# EAGLE design LooSensorNodeV1 (EAGLE 8.7.0)

## Sheet 1 of 5
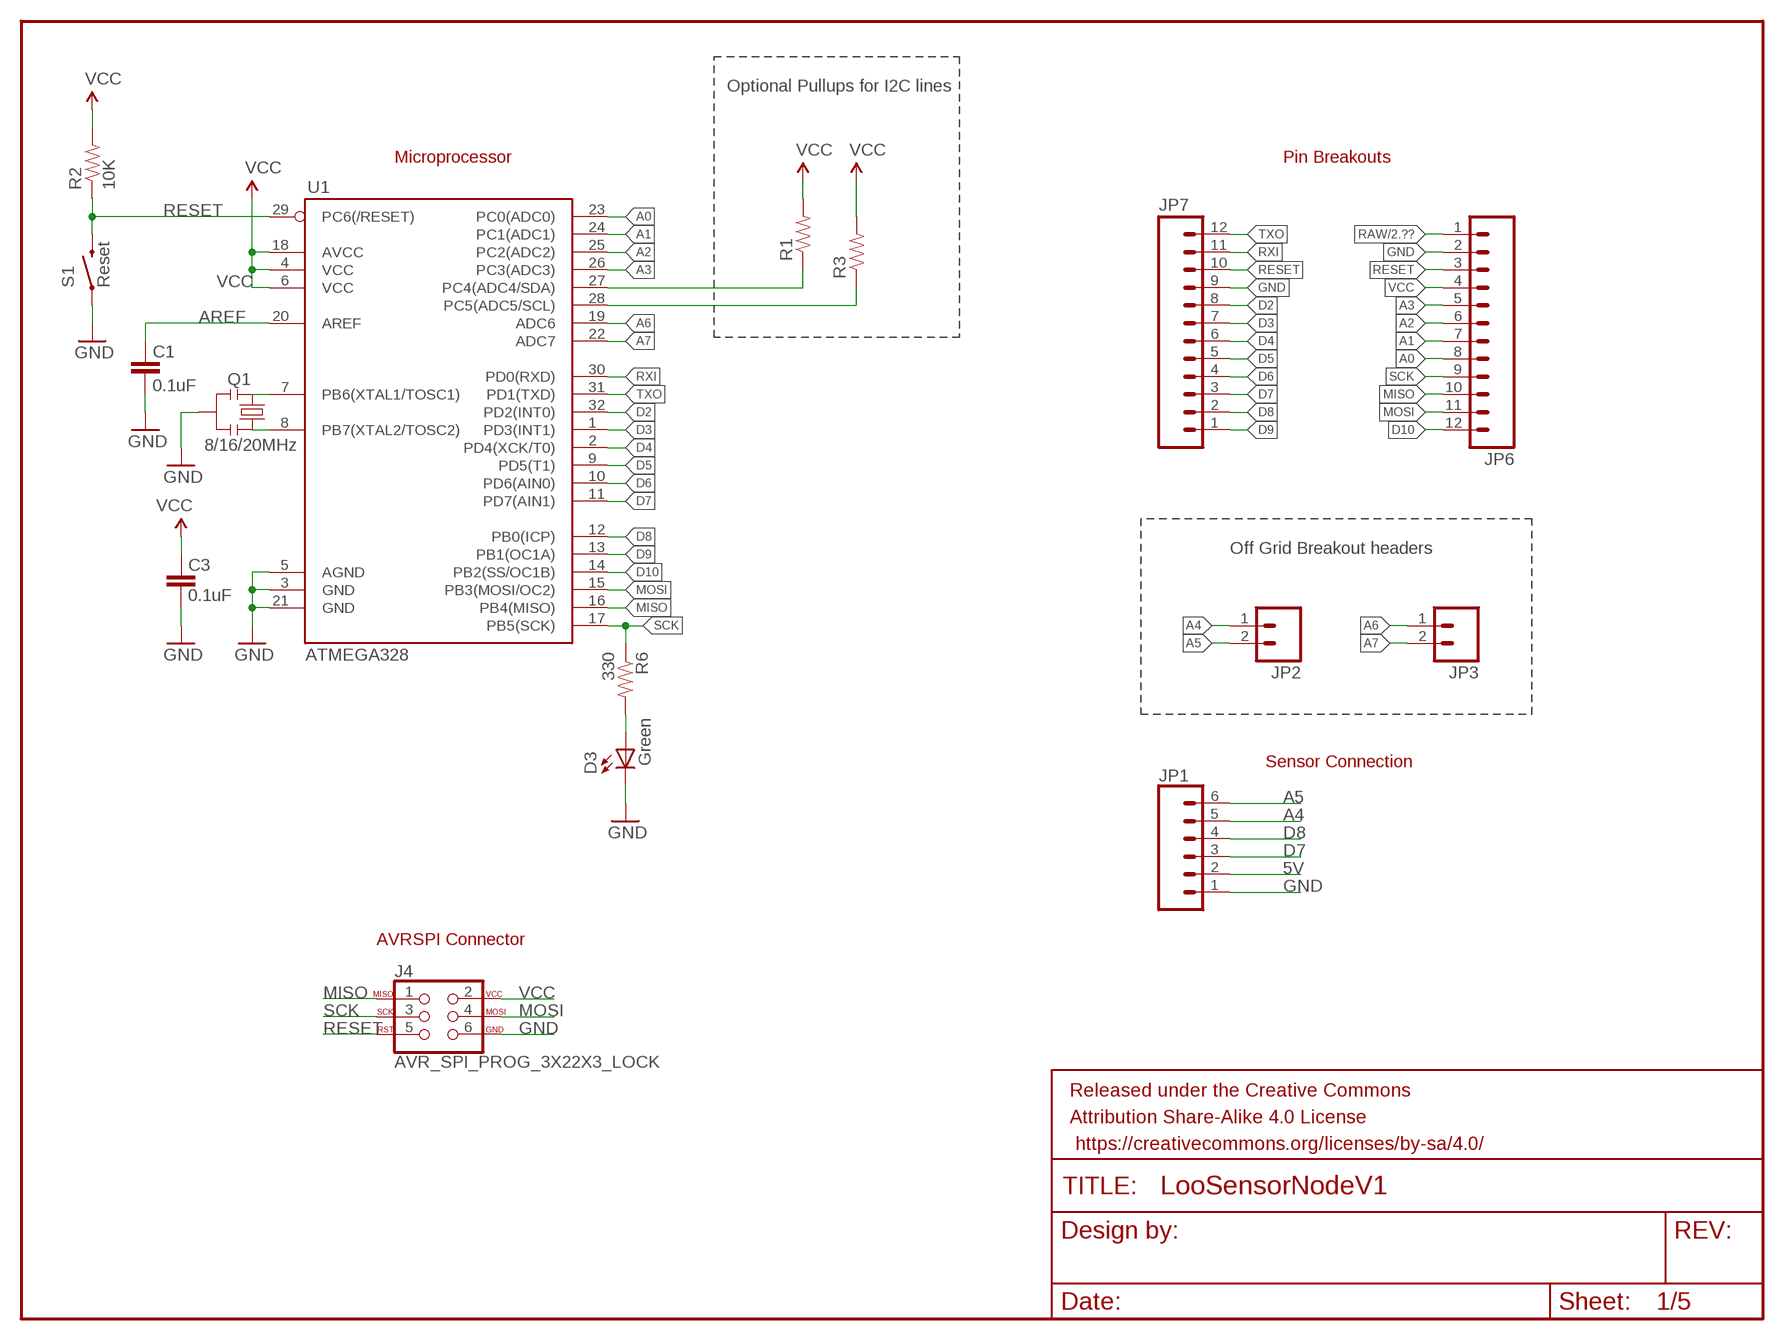
[diagram p0: schematic, sheet 1]

### Parts
C1  0.1uF  CAP0603-CAP  [0603-CAP]
C3  0.1uF  CAP0603-CAP  [0603-CAP]
D3  Green  LED  [0603-LED-ALT1]
FRAME1  FRAME-LETTER  [CREATIVE_COMMONS]
J4  AVR_SPI_PROG_3X22X3_LOCK  [2X3_LOCK]
JP1  CONN_06SILK_FEMALE_PTH  [1X06]
JP2  M02PTH  [1X02]
JP3  M02PTH  [1X02]
JP6  M12PTH  [1X12]
JP7  M12PTH  [1X12]
Q1  8/16/20MHz  RESONATOR1:1  [RESONATOR-SMD-1:1]
R1  RESISTOR0603-RES  [0603-RES]
R2  10K  RESISTOR0603-RES  [0603-RES]
R3  RESISTOR0603-RES  [0603-RES]
R6  330  RESISTOR0603-RES  [0603-RES]
S1  Reset  SWITCH-MOMENTARY-2SMD-ALT01  [TACTILE-SWITCH-SMD-ALT01]
U1  ATMEGA328  ATMEGA168  [TQFP32-08]

### Nets
5V: JP1.2 ; also sheet 2
A0: JP6.8 U1.23(PC0(ADC0))
A1: JP6.7 U1.24(PC1(ADC1))
A2: JP6.6 U1.25(PC2(ADC2))
A3: JP6.5 U1.26(PC3(ADC3))
A4: JP1.5 JP2.1 R1.1 U1.27(PC4(ADC4/SDA)) ; also sheet 5
A5: JP1.6 JP2.2 R3.1 U1.28(PC5(ADC5/SCL)) ; also sheet 5
A6: JP3.1 U1.19(ADC6)
A7: JP3.2 U1.22(ADC7)
AREF: C1.2 U1.20(AREF)
D2: JP7.8 U1.32(PD2(INT0)) ; also sheet 5
D3: JP7.7 U1.1(PD3(INT1))
D4: JP7.6 U1.2(PD4(XCK/T0)) ; also sheet 4
D5: JP7.5 U1.9(PD5(T1)) ; also sheet 3,4
D6: JP7.4 U1.10(PD6(AIN0)) ; also sheet 2
D7: JP1.3 JP7.3 U1.11(PD7(AIN1))
D8: JP1.4 JP7.2 U1.12(PB0(ICP))
D9: JP7.1 U1.13(PB1(OC1A))
D10: JP6.12 U1.14(PB2(SS/OC1B)) ; also sheet 3
GND [vcc]: C1.1 C3.1 D3.C J4.6 JP1.1 JP6.2 JP7.9 Q1.2 S1.1 S1.2 U1.3(GND) U1.5(AGND) U1.21(GND) ; also sheet 2,3,4,5
MISO: J4.1 JP6.10 U1.16(PB4(MISO)) ; also sheet 3
MOSI: J4.4 JP6.11 U1.15(PB3(MOSI/OC2)) ; also sheet 3
N$1: Q1.3 U1.8(PB7(XTAL2/TOSC2))
N$2: Q1.1 U1.7(PB6(XTAL1/TOSC1))
N$7: D3.A R6.2
RAW [vcc]: JP6.1 ; also sheet 2,5
RESET: J4.5 JP6.3 JP7.10 R2.1 S1.3 S1.4 U1.29(PC6(/RESET))
RXI: JP7.11 U1.30(PD0(RXD)) ; also sheet 4
SCK: J4.3 JP6.9 R6.1 U1.17(PB5(SCK)) ; also sheet 3
TXO: JP7.12 U1.31(PD1(TXD)) ; also sheet 4
VCC: C3.2 J4.2 JP6.4 R1.2 R2.2 R3.2 U1.4(VCC) U1.6(VCC) U1.18(AVCC) ; also sheet 2

### Notes on the sheet
- Optional Pullups for I2C lines
- Microprocessor | Pin Breakouts
- Off Grid Breakout headers
- Sensor Connection
- AVRSPI Connector

## Sheet 2 of 5
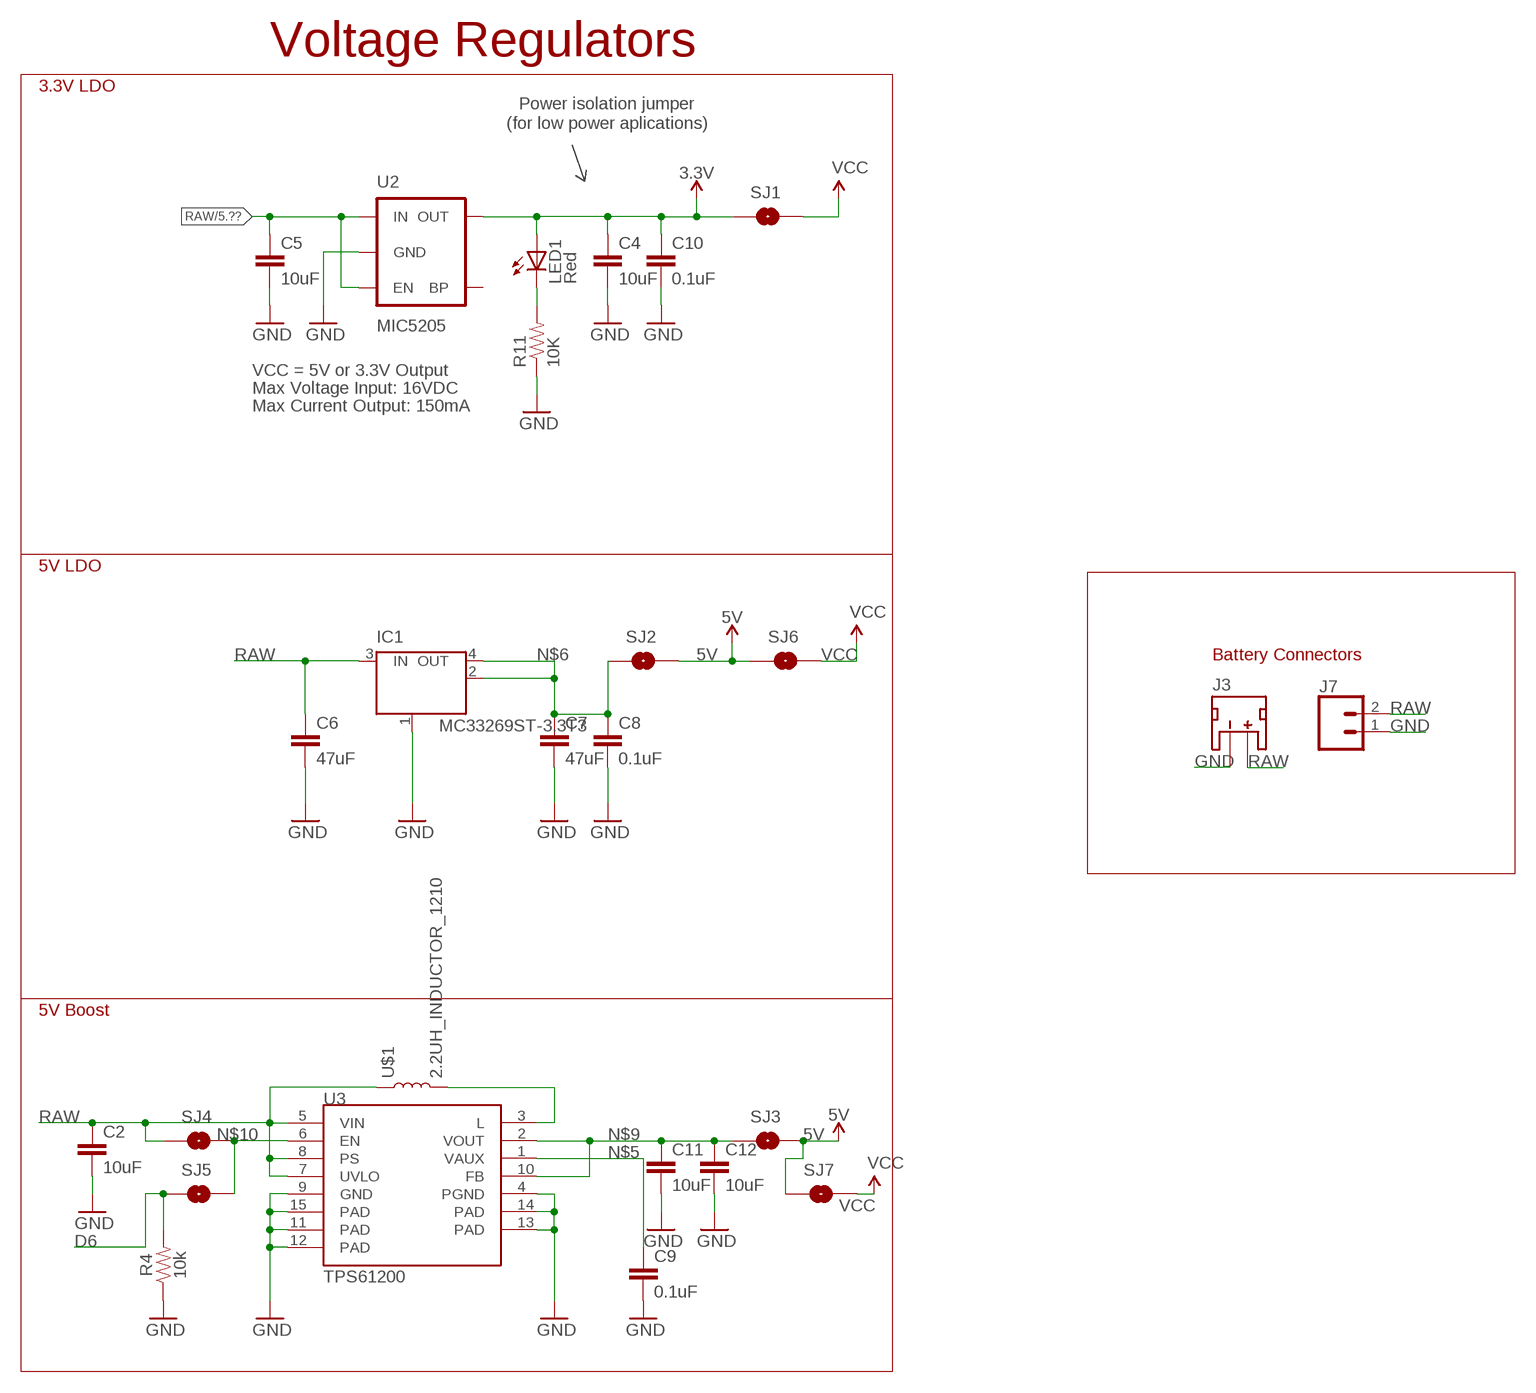
[diagram p1: schematic, sheet 2]

### Parts
C2  10uF  10UF-0603-6.3V-20%  [0603]
C4  10uF  10UF-0603-6.3V-20%  [0603]
C5  10uF  10UF-0603-6.3V-20%  [0603]
C6  47uF  10UF-1210-50V-20%  [1210]
C7  47uF  10UF-1210-50V-20%  [1210]
C8  0.1uF  0.1UF-0603-25V-5%  [0603]
C9  0.1uF  0.1UF-0603-25V-5%  [0603]
C10  0.1uF  CAP0603-CAP  [0603-CAP]
C11  10uF  10UF-0603-6.3V-20%  [0603]
C12  10uF  10UF-0603-6.3V-20%  [0603]
IC1  MC33269ST-3.3T3  [SOT223]
J3  JST_2MM_MALE  [JST-2-SMD]
J7  CONN_02  [1X02]
LED1  Red  LED  [0603-LED-ALT1]
R4  10k  10KOHM-0603-1/10W-1%  [0603]
R11  10K  RESISTOR0603-RES  [0603-RES]
SJ1  SOLDERJUMPERNC  [SJ_2S]
SJ2  SOLDERJUMPERNC  [SJ_2S]
SJ3  SOLDERJUMPERNC  [SJ_2S]
SJ4  SOLDERJUMPERNC  [SJ_2S]
SJ5  SOLDERJUMPERNC  [SJ_2S]
SJ6  SOLDERJUMPERNC  [SJ_2S]
SJ7  SOLDERJUMPERNC  [SJ_2S]
U2  MIC5205  V_REG_LDOSMD  [SOT23-5]
U3  TPS61200  [QFN-10_PAD]
U$1  2.2UH_INDUCTOR_1210  [1210]

### Nets
3.3V: C4.1 C10.1 LED1.A SJ1.1 U2.5(OUT) ; also sheet 3,4
5V: SJ2.2 SJ3.2 SJ6.1 SJ7.1 ; also sheet 1
D6: R4.2 SJ5.1 ; also sheet 1
GND [vcc]: C2.2 C4.2 C5.2 C6.2 C7.2 C8.2 C9.2 C10.2 C11.2 C12.2 IC1.1(GND/ADJ) J3.1(-) J7.1 R4.1 R11.1 U2.2(GND) U3.4(PGND) U3.9(GND) U3.11(PAD) U3.12(PAD) U3.13(PAD) U3.14(PAD) U3.15(PAD) ; also sheet 1,3,4,5
N$4: LED1.C R11.2
N$5: C9.1 U3.1(VAUX)
N$6: C7.1 C8.1 IC1.2(OUT) IC1.4(OUT) SJ2.1
N$8: U3.3(L) U$1.2
N$9: C11.1 C12.1 SJ3.1 U3.2(VOUT) U3.10(FB)
N$10: SJ4.2 SJ5.2 U3.6(EN)
RAW [vcc]: C2.1 C5.1 C6.1 IC1.3(IN) J3.2(+) J7.2 SJ4.1 U2.1(IN) U2.3(EN) U3.5(VIN) U3.7(UVLO) U3.8(PS) U$1.1 ; also sheet 1,5
VCC: SJ1.2 SJ6.2 SJ7.2 ; also sheet 1
Unconnected: J3.NC1(PAD1) J3.NC2(PAD2) U2.4(BP)

### Notes on the sheet
- Voltage Regulators
- 3.3V LDO
- Power isolation jumper
- (for low power aplications)
- VCC = 5V or 3.3V Output
- Max Voltage Input: 16VDC
- Max Current Output: 150mA
- 5V LDO
- Battery Connectors
- 5V Boost

## Sheet 3 of 5
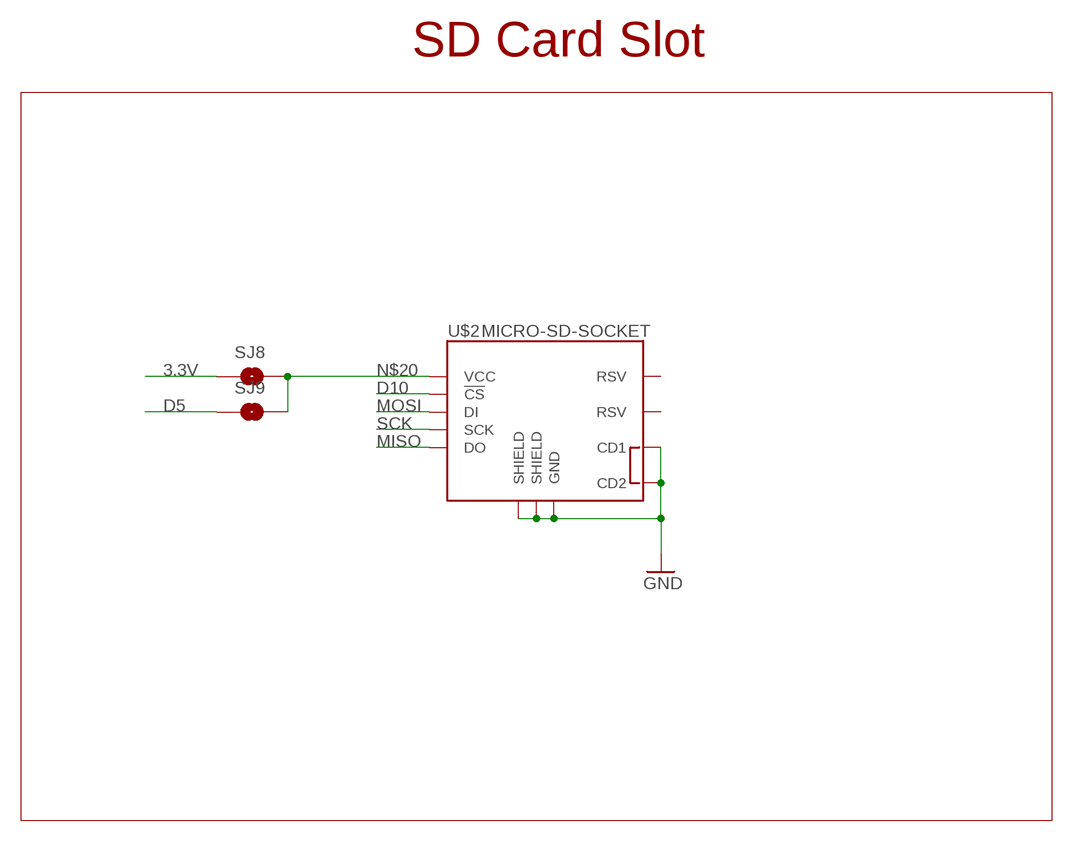
[diagram p2: schematic, sheet 3]

### Parts
SJ8  SOLDERJUMPERNC  [SJ_2S]
SJ9  SOLDERJUMPERNC  [SJ_2S]
U$2  MICRO-SD-SOCKET  [MICRO-SD-SOCKET]

### Nets
3.3V: SJ8.1 ; also sheet 2,4
D5: SJ9.1 ; also sheet 1,4
D10: U$2.CS(!CS) ; also sheet 1
GND [vcc]: U$2.CD1 U$2.CD2 U$2.GND U$2.GND1(SHIELD) U$2.GND3(SHIELD) ; also sheet 1,2,4,5
MISO: U$2.DO ; also sheet 1
MOSI: U$2.DI ; also sheet 1
N$20: SJ8.2 SJ9.2 U$2.VCC ; also sheet 4
SCK: U$2.SCLK(SCK) ; also sheet 1
Unconnected: U$2.RSV1(RSV) U$2.RSV2(RSV)

### Notes on the sheet
- SD Card Slot

## Sheet 4 of 5
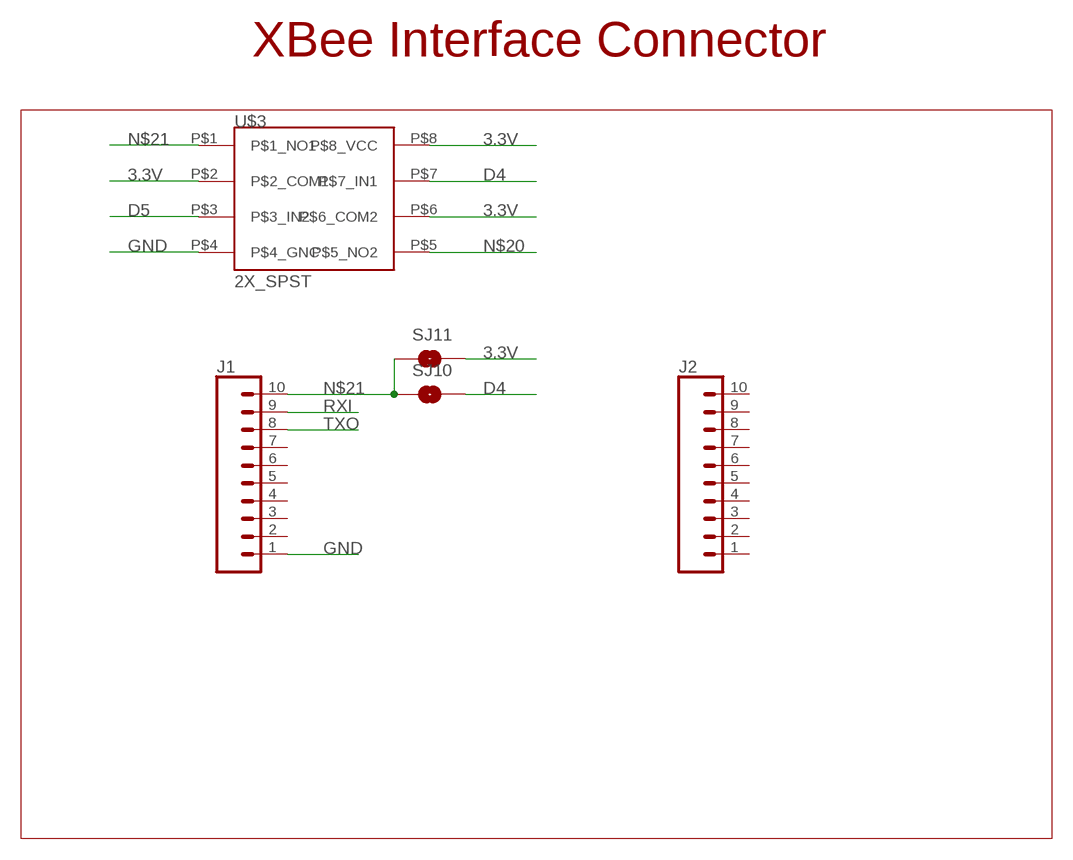
[diagram p3: schematic, sheet 4]

### Parts
J1  CONN_102MM  [1X10-2MM]
J2  CONN_102MM  [1X10-2MM]
SJ10  SOLDERJUMPERNC  [SJ_2S]
SJ11  SOLDERJUMPERNC  [SJ_2S]
U$3  2X_SPST  [2X_SPST]

### Nets
3.3V: SJ11.2 U$3.P$2(P$2_COM1) U$3.P$6(P$6_COM2) U$3.P$8(P$8_VCC) ; also sheet 2,3
D4: SJ10.2 U$3.P$7(P$7_IN1) ; also sheet 1
D5: U$3.P$3(P$3_IN2) ; also sheet 1,3
GND [vcc]: J1.1 U$3.P$4(P$4_GNC) ; also sheet 1,2,3,5
N$20: U$3.P$5(P$5_NO2) ; also sheet 3
N$21: J1.10 SJ10.1 SJ11.1 U$3.P$1(P$1_NO1)
RXI: J1.9 ; also sheet 1
TXO: J1.8 ; also sheet 1
Unconnected: J1.2 J1.3 J1.4 J1.5 J1.6 J1.7 J2.1 J2.2 J2.3 J2.4 J2.5 J2.6 J2.7 J2.8 J2.9 J2.10

### Notes on the sheet
- XBee Interface Connector

## Sheet 5 of 5
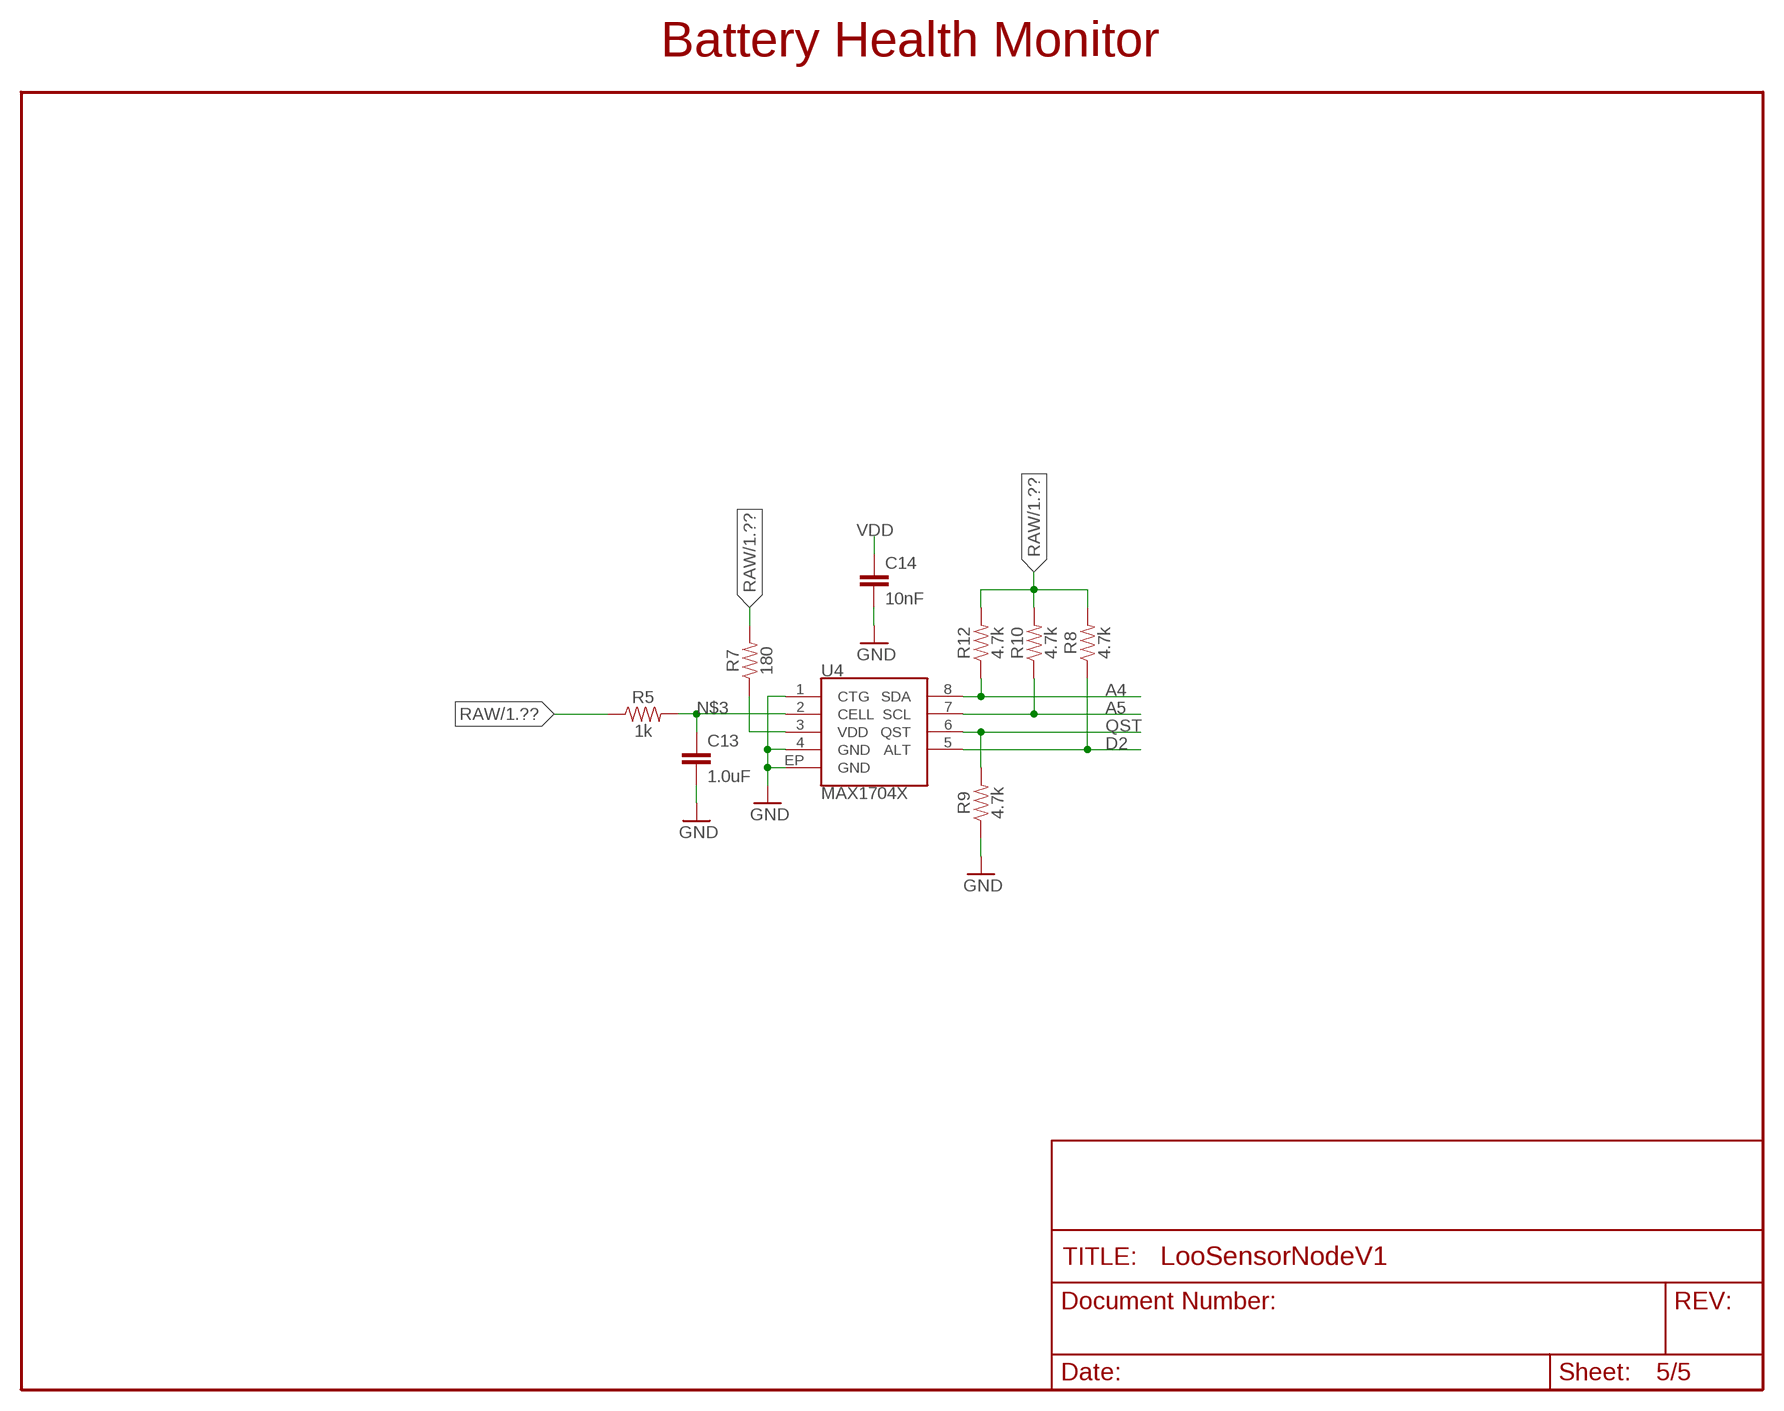
[diagram p4: schematic, sheet 5]

### Parts
C13  1.0uF  1.0UF-0603-16V-10%  [0603]
C14  10nF  10NF-0603-50V-10%  [0603]
R5  1k  1KOHM-0603-1/10W-1%  [0603]
R7  180  180OHM-0603-1/10W-1%  [0603]
R8  4.7k  4.7KOHM-0603-1/10W-1%  [0603]
R9  4.7k  4.7KOHM-0603-1/10W-1%  [0603]
R10  4.7k  4.7KOHM-0603-1/10W-1%  [0603]
R12  4.7k  4.7KOHM-0603-1/10W-1%  [0603]
U4  MAX1704X  [TDFN-8]

### Nets
A4: R12.1 U4.8(SDA) ; also sheet 1
A5: R10.1 U4.7(SCL) ; also sheet 1
D2: R8.1 U4.5(ALT) ; also sheet 1
GND [vcc]: C13.2 C14.2 R9.1 U4.1(CTG) U4.4(GND) U4.EP(GND) ; also sheet 1,2,3,4
N$3: C13.1 R5.2 U4.2(CELL)
QST: R9.2 U4.6(QST)
RAW [vcc]: R5.1 R7.2 R8.2 R10.2 R12.2 ; also sheet 1,2
VDD: C14.1 R7.1 U4.3(VDD)

### Notes on the sheet
- Battery Health Monitor

## Library data of the parts
C1 C3 C10 = SparkFun:CAP: Capacitor Standard 0603 ceramic capacitor, and 0.1" leaded capacitor.
C2 C4 C5 C11 C12 = SparkFun-Capacitors:10UF: 10.0µF ceramic capacitors A capacitor is a passive two-terminal electrical component used to store electrical energy temporarily in an electric field.; PROD_ID: CAP-11015
C6 C7 = SparkFun-Capacitors:10UF: 10.0µF ceramic capacitors A capacitor is a passive two-terminal electrical component used to store electrical energy temporarily in an electric field.; PROD_ID: CAP-09824; VALUE: 10uF
C8 C9 = SparkFun-Capacitors:0.1UF: 0.1µF ceramic capacitors A capacitor is a passive two-terminal electrical component used to store electrical energy temporarily in an electric field.; PROD_ID: CAP-08604
C13 = SparkFun-Capacitors:1.0UF: 1µF ceramic capacitors A capacitor is a passive two-terminal electrical component used to store electrical energy temporarily in an electric field.; PROD_ID: CAP-00868
C14 = SparkFun-Capacitors:10NF: 0.01uF/10nF/10,000pF ceramic capacitors A capacitor is a passive two-terminal electrical component used to store electrical energy temporarily in an electric field. CAP-09321; PROD_ID: CAP-00867
D3 LED1 = Testing:LED: LEDs Standard schematic elements and footprints for 5mm, 3mm, 1206, and 0603 sized LEDs. 5mm - Spark Fun Electronics SKU : COM-00529 (and others)
FRAME1 = SparkFun-Aesthetics:FRAME-LETTER: Schematic Frame - Letter Standard 8.5x11 US Letter frame
IC1 = linear:MC33269ST*: Adjustable Output Low Dropout Voltage Regulator 800 mA Source: http://www.onsemi.com/pub/Collateral/MC33269-D.PDF
J1 J2 = SparkFun-Connectors:CONN_10: Multi connection point. Often used as Generic Header-pin footprint for 0.1 inch spaced/style header connections On any of the 0.1 inch spaced packages, you can populate with these: Break Away Headers - Straight <https://www.sparkfun.com/products/116> (PRT-00116) Break Away Male Headers - Right Angle <https://www.sparkfun.com/products/553> (PRT-00553) Female Headers <https://www.sparkfun.com/products/115> (PRT-00115) Break Away Headers - Machine Pin <https://www.sparkfun.com/products/117> (PRT-00117) Break Away Female Headers - Swiss Machine Pin <https://www.sparkfun.com/products/743> (PRT-00743) Arduino Stackable Header - 10 Pin <https://www.sparkfun.com/products/11376> (PRT-11376) For SCREWTERMINALS and SPRING TERMINALS visit here: Screw Terimnals on SparkFun.com <https://www.sparkfun.com/search/results?term=Screw+Terminals> (5mm/3.5mm/2.54mm spacing) This device is also useful as a general connection point to wire up your design to another part of your project. Our various solder wires solder well into these plated through hole pads. Hook-Up Wire - Assortment (Stranded, 22 AWG) <https://www.sparkfun.com/products/11375> (PRT-11375) Hook-Up Wire - Assortment (Solid Core, 22 AWG) <https://www.sparkfun.com/products/11367> (PRT-11367) View the entire wire category on our website here <https://www.sparkfun.com/categories/141> Special notes: Molex polarized connector foot print use with SKU : PRT-08231 with associated crimp pins and housings. 1MM SMD Version SKU: PRT-10208 NOTES ON THE VARIANTS LOCK and LOCK_LONGPADS... This footprint was designed to help hold the alignment of a through-hole component (i.e. 6-pin header) while soldering it into place. You may notice that each hole has been shifted either up or down by 0.005 of an inch from it's more standard position (which is a perfectly straight line). This slight alteration caused the pins (the squares in the middle) to touch the edges of the holes. Because they are alternating, it causes a "brace" to hold the component in place. 0.005 has proven to be the perfect amount of "off-center" position when using our standard breakaway headers. Although looks a little odd when you look at the bare footprint, once you have a header in there, the alteration is very hard to notice. Also,if you push a header all the way into place, it is covered up entirely on the bottom side.; PROD_ID: CONN-08875; SF_ID: PRT-08272
J3 = SparkFun-Connectors:JST_2MM_MALE: JST 2MM MALE RA CONNECTOR Two pin, compact surface mount connector. Commonly used as a battery input connection point. We really like the solid locking feeling and high current rating on these small connectors. We use these all the time as battery connectors. Mates to single-cell LiPo batteries. Here is the connector we sell at SparkFun: JST Right Angle Connector - White <https://www.sparkfun.com/products/8612> (PRT-08612) Datasheet <http://www.sparkfun.com/datasheets/Prototyping/Connectors/JST-Horizontal.pdf> It was used on these SparkFun products: SparkFun MOSFET Power Controller <https://www.sparkfun.com/products/11214> (PRT-11214) SparkFun Battery Babysitter - LiPo Battery Manager <https://www.sparkfun.com/products/13777> (PRT-13777) And many, many others that required a lipo battery connection.; PROD_ID: CONN-11443; SF_ID: PRT-08612
J4 = SparkFun-Connectors:AVR_SPI_PROG_3X2: AVR ISP 6 Pin This is the reduced ISP connector for AVR programming. Common on Arduino. This footprint will take up less PCB space and can be used with a 10-pin to 6-pin adapter such as SKU: BOB-08508 **Special note about "TEST_POINT" package. The stop mask is on the top side, so if you want your programming test points to be on the bottom of your board, make sure to place this package on the bottom side of the board. This also ensure that the orientation to program from the bottom side will be correct. SparkFun Products: SparkFun ISP Pogo Adapter <https://www.sparkfun.com/products/11591> - NS Tiny AVR Programmer <https://www.sparkfun.com/products/11801> -PTH
J7 = SparkFun-Connectors:CONN_02: Multi connection point. Often used as Generic Header-pin footprint for 0.1 inch spaced/style header connections On any of the 0.1 inch spaced packages, you can populate with these: Break Away Headers - Straight <https://www.sparkfun.com/products/116> (PRT-00116) Break Away Male Headers - Right Angle <https://www.sparkfun.com/products/553> (PRT-00553) Female Headers <https://www.sparkfun.com/products/115> (PRT-00115) Break Away Headers - Machine Pin <https://www.sparkfun.com/products/117> (PRT-00117) Break Away Female Headers - Swiss Machine Pin <https://www.sparkfun.com/products/743> (PRT-00743) For SCREWTERMINALS and SPRING TERMINALS visit here: Screw Terimnals on SparkFun.com <https://www.sparkfun.com/search/results?term=Screw+Terminals> (5mm/3.5mm/2.54mm spacing) This device is also useful as a general connection point to wire up your design to another part of your project. Our various solder wires solder well into these plated through hole pads. Hook-Up Wire - Assortment (Stranded, 22 AWG) <https://www.sparkfun.com/products/11375> (PRT-11375) Hook-Up Wire - Assortment (Solid Core, 22 AWG) <https://www.sparkfun.com/products/11367> (PRT-11367) View the entire wire category on our website here <https://www.sparkfun.com/categories/141> Special notes: Molex polarized connector foot print use with: PRT-08233 with associated crimp pins and housings. 2.54_SCREWTERM for use with PRT-10571. 3.5mm Screw Terminal footprints for PRT-08084 5mm Screw Terminal footprints for use with PRT-08432
JP1 = SparkFun-Connectors:CONN_06: Multi connection point. Often used as Generic Header-pin footprint for 0.1 inch spaced/style header connections On any of the 0.1 inch spaced packages, you can populate with these: Break Away Headers - Straight <https://www.sparkfun.com/products/116> (PRT-00116) Break Away Male Headers - Right Angle <https://www.sparkfun.com/products/553> (PRT-00553) Female Headers <https://www.sparkfun.com/products/115> (PRT-00115) Break Away Headers - Machine Pin <https://www.sparkfun.com/products/117> (PRT-00117) Break Away Female Headers - Swiss Machine Pin <https://www.sparkfun.com/products/743> (PRT-00743) Arduino Stackable Header - 6 Pin <https://www.sparkfun.com/products/9280> (PRT-09280) For SCREWTERMINALS and SPRING TERMINALS visit here: Screw Terimnals on SparkFun.com <https://www.sparkfun.com/search/results?term=Screw+Terminals> (5mm/3.5mm/2.54mm spacing) This device is also useful as a general connection point to wire up your design to another part of your project. Our various solder wires solder well into these plated through hole pads. Hook-Up Wire - Assortment (Stranded, 22 AWG) <https://www.sparkfun.com/products/11375> (PRT-11375) Hook-Up Wire - Assortment (Solid Core, 22 AWG) <https://www.sparkfun.com/products/11367> (PRT-11367) View the entire wire category on our website here <https://www.sparkfun.com/categories/141>; PROD_ID: CONN-08437
JP2 JP3 = SparkFun:M02: Header 2 Standard 2-pin 0.1" header. Use with straight break away headers (SKU : PRT-00116), right angle break away headers (PRT-00553), swiss pins (PRT-00743), machine pins (PRT-00117), and female headers (PRT-00115). Molex polarized connector foot print use with SKU : PRT-08233 with associated crimp pins and housings.
JP6 JP7 = SparkFun:M12: Header 12 Standard 12-pin 0.1" header. Use with straight break away headers (SKU : PRT-00116), right angle break away headers (PRT-00553), swiss pins (PRT-00743), machine pins (PRT-00117), and female headers (PRT-00115).
Q1 = Testing:RESONATOR: Resonator Small SMD resonator. This is the itty bitty 10/20MHz resonators with built in caps. CSTCE10M0G55 and CSTCE20M0V53. Footprint for SMD has been used in SFE production for years, and does work okay. 1:1 is an attempt to get larger fillets on the sides so it will be easier to inspect these solders in our AOI machine. The pads have been minimized to match the actual metal under the resonator. To see this relation, it includes an image import of the bottom side of the component. Imported to scale on layer 200.
R1-R3 R6 R11 = SparkFun:RESISTOR: Resistor Basic schematic elements and footprints for 0603, 1206, and PTH resistors.
R4 = SparkFun-Resistors:10KOHM: 10kΩ resistor A resistor is a passive two-terminal electrical component that implements electrical resistance as a circuit element. Resistors act to reduce current flow, and, at the same time, act to lower voltage levels within circuits. - Wikipedia; PROD_ID: RES-00824
R5 = SparkFun-Resistors:1KOHM: 1kΩ resistor A resistor is a passive two-terminal electrical component that implements electrical resistance as a circuit element. Resistors act to reduce current flow, and, at the same time, act to lower voltage levels within circuits. - Wikipedia; PROD_ID: RES-07856
R7 = SparkFun-Resistors:180OHM: 180Ω resistor A resistor is a passive two-terminal electrical component that implements electrical resistance as a circuit element. Resistors act to reduce current flow, and, at the same time, act to lower voltage levels within circuits. - Wikipedia; PROD_ID: RES-08788
R8-R10 R12 = SparkFun-Resistors:4.7KOHM: 4.7kΩ resistor A resistor is a passive two-terminal electrical component that implements electrical resistance as a circuit element. Resistors act to reduce current flow, and, at the same time, act to lower voltage levels within circuits. - Wikipedia; PROD_ID: RES-07857
S1 = Testing:SWITCH-MOMENTARY-2: Various NO switches- pushbuttons, reed, etc
SJ1-SJ11 = SparkFun-Passives:SOLDERJUMPER: Solder Jumper Standard SMD solder jumper. Used to automate production. Two varients : Normally Open and Normally Closed are the same, but have different paste layers. NC will have a large amount of paste and should jumper during reflow.
U1 = SparkFun:ATMEGA168
U2 = SparkFun:V_REG_LDO: Voltage Regulator LDO Standard 150mA LDO voltage regulator in SOT-23 layout. Micrel part MIC5205. BP (by-pass) pin is used to lower output noise with 470pF cap.
U3 = SparkFun-IC-Power:TPS61200: DC to DC Booster IC-10035; PROD_ID: IC-10035
U4 = SparkFun:MAX1704X: MAX17043/MAX17044: Battery Fuel Guage (43 is 1cell, 44 is 2cell)
U$1 = Loo:2.2UH_INDUCTOR_1210
U$2 = Loo:MICRO-SD-SOCKET
U$3 = Loo:2X_SPST

## Net classes
0 default: width 0.203 mm
1 vcc: width 0.254 mm

## Board
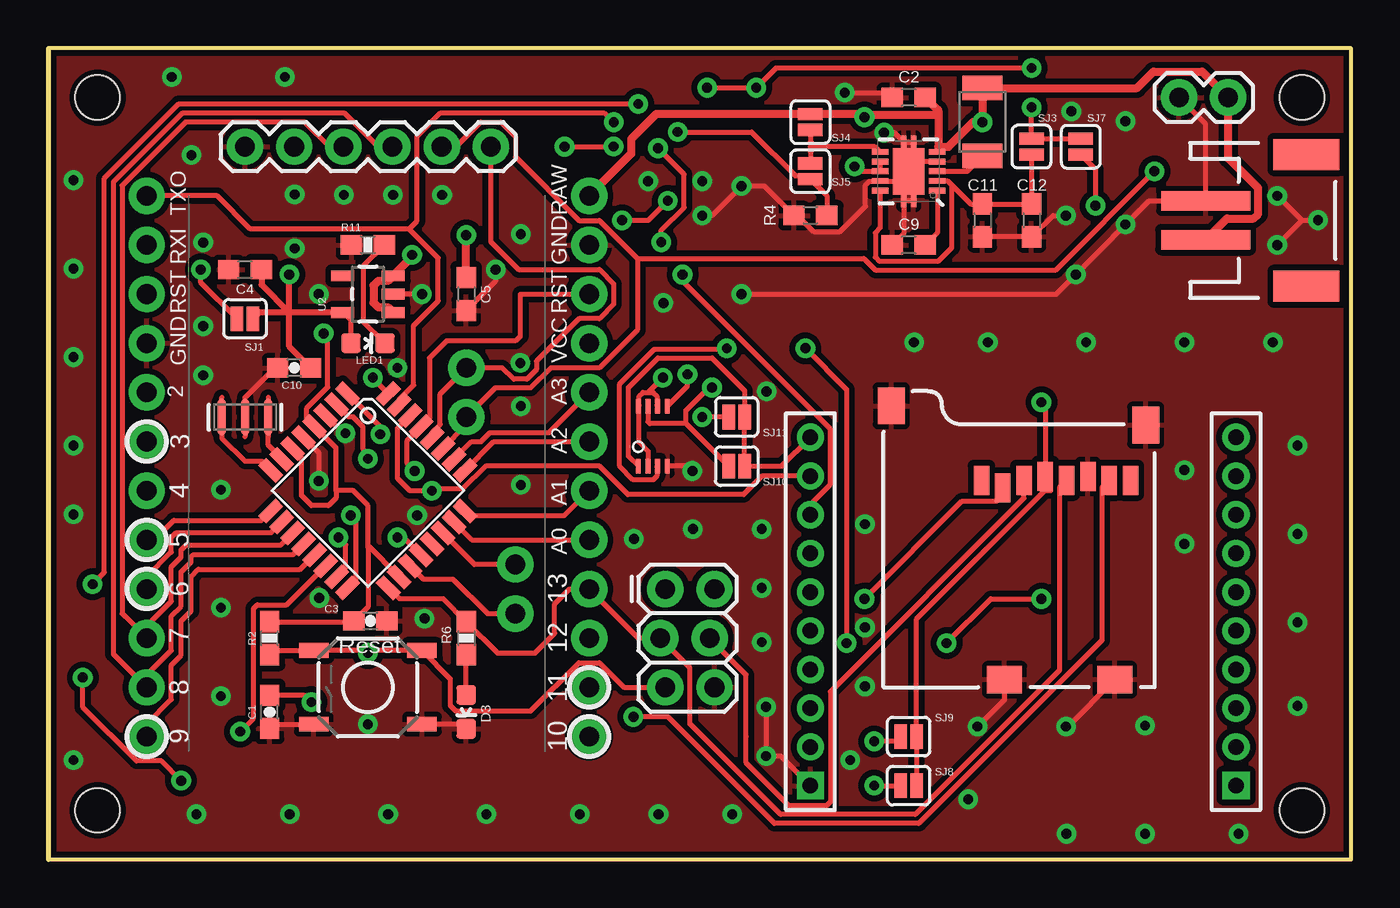
[diagram p5: board, top side]
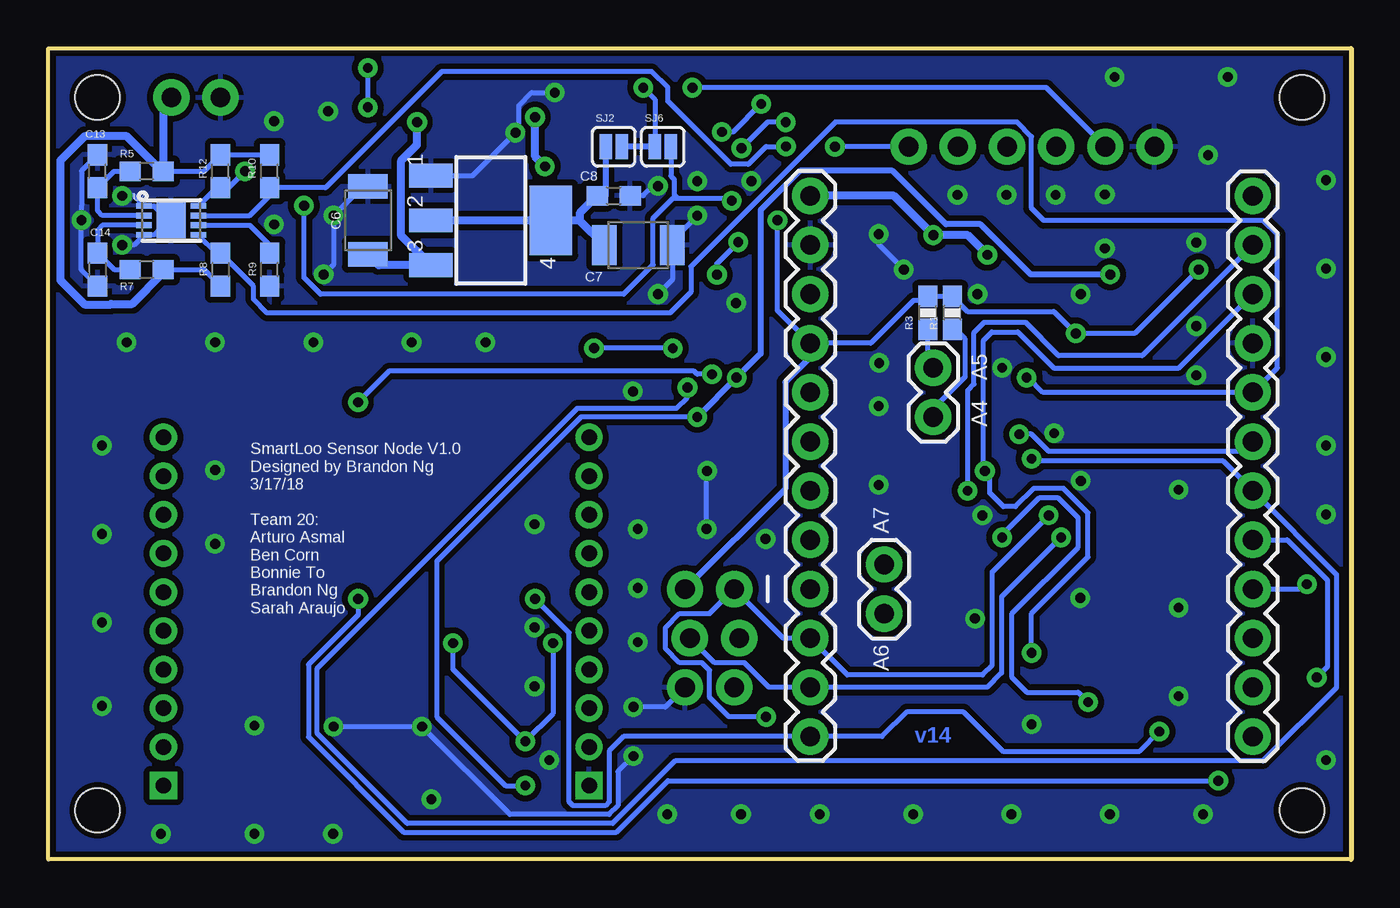
[diagram p6: board, bottom side, seen from below]

Size 67.31 x 41.91 mm. Coordinates in mm from the lower left corner, seen from the top.
Outline: 0,0 67.31,0 67.31,41.91 0,41.91 0,0
Copper layers (1*16): Top 0.035mm / dielectric 1.5mm / Bottom 0.035mm
Design rules "SparkFun-2-layer *": minimum track width 7mil, minimum drill 15mil, track to track 8mil, track to pad 8mil, pad to pad 8mil, via to via 8mil, smd to smd 8mil, copper to edge 8mil, drill to drill 8mil, minimum pad ring 12mil, minimum via ring 10mil, stop-mask expansion 4mil, vias tented up to drill 20mil, thermal gap 10mil
Holes 2.29 mm at 64.77,39.37 2.54,39.37 2.54,2.54 64.77,2.54

### Footprints (pad centres in the part's own frame; a part is rotated, then mirrored left to right if it is on the bottom)
0603-CAP = smd 1.1 x 1: 1 -0.85,0; 2 0.85,0
0603 = smd 1.1 x 1: 1 -0.85,0; 2 0.85,0
1210 = smd 1.27 x 2.06: 1 -1.755,0; 2 1.755,0
0603-LED-ALT1 = smd 1 x 1: A 0,-0.877; C 0,0.877
SOT223 = smd 1.219 x 2.235: 1 -2.311,-3.099; 2 0,-3.099; 3 2.311,-3.099 | smd 3.6 x 2.2: 4 0,3.099
1X10-2MM = drill 0.8 square: 1 0,0 | drill 0.8: 2 2,0; 3 4,0; 4 6,0; 5 8,0; 6 10,0; 7 12,0; 8 14,0; 9 16,0; 10 18,0
JST-2-SMD = smd 1 x 4.6: 1 -1,-3.7; 2 1,-3.7 | smd 1.6 x 3.4: NC1 -3.4,1.5; NC2 3.4,1.5
2X3_LOCK = drill 1.016 pad 1.88: 1 0,0.127; 2 0,2.667; 3 2.54,-0.127; 4 2.54,2.413; 5 5.08,0.127; 6 5.08,2.667
1X02 = drill 1.016 pad 1.88: 1 0,0; 2 2.54,0
1X06 = drill 1.016 pad 1.88: 1 0,0; 2 2.54,0; 3 5.08,0; 4 7.62,0; 5 10.16,0; 6 12.7,0
1X12 = drill 1.016 pad 1.88: 1 0,0; 2 2.54,0; 3 5.08,0; 4 7.62,0; 5 10.16,0; 6 12.7,0; 7 15.24,0; 8 17.78,0; 9 20.32,0; 10 22.86,0; 11 25.4,0; 12 27.94,0
RESONATOR-SMD-1:1 = smd 0.45 x 1.905: 1 -1.2,0; 2 0,0; 3 1.2,0
0603-RES = smd 1.1 x 1: 1 -0.85,0; 2 0.85,0
TACTILE-SWITCH-SMD-ALT01 = smd 1.524 x 0.762: 1 -2.794,1.905; 2 2.794,1.905; 3 -2.794,-1.905; 4 2.794,-1.905
SJ_2S = smd 0.635 x 1.27: 1 -0.412,0; 2 0.412,0
TQFP32-08 = smd 1.27 x 0.559: 1 -4.293,2.8; 2 -4.293,2; 3 -4.293,1.2; 4 -4.293,0.4; 5 -4.293,-0.4; 6 -4.293,-1.2; 7 -4.293,-2; 8 -4.293,-2.8; 17 4.293,-2.8; 18 4.293,-2; 19 4.293,-1.2; 20 4.293,-0.4; 21 4.293,0.4; 22 4.293,1.2; 23 4.293,2; 24 4.293,2.8 | smd 0.559 x 1.27: 9 -2.8,-4.293; 10 -2,-4.293; 11 -1.2,-4.293; 12 -0.4,-4.293; 13 0.4,-4.293; 14 1.2,-4.293; 15 2,-4.293; 16 2.8,-4.293; 25 2.8,4.293; 26 2,4.293; 27 1.2,4.293; 28 0.4,4.293; 29 -0.4,4.293; 30 -1.2,4.293; 31 -2,4.293; 32 -2.8,4.293
SOT23-5 = smd 0.55 x 1.2: 1 -0.95,-1.3; 2 0,-1.3; 3 0.95,-1.3; 4 0.95,1.3; 5 -0.95,1.3
QFN-10_PAD = smd 0.297 x 0.85: 1 -1,-1.475; 2 -0.5,-1.475; 3 0,-1.475; 4 0.5,-1.475; 5 1,-1.475; 6 1,1.475; 7 0.5,1.475; 8 0,1.475; 9 -0.5,1.475; 10 -1,1.475 | smd 0.7 x 0.28: 11 -1.5,0.25; 12 -1.5,-0.25; 13 1.5,0.25; 14 1.5,-0.25 | smd 2.4 x 1.65: 15 0,0
TDFN-8 = smd 0.8 x 0.3: 1 -1.4,0.75; 2 -1.4,0.25; 3 -1.4,-0.25; 4 -1.4,-0.75; 5 1.4,-0.75; 6 1.4,-0.25; 7 1.4,0.25; 8 1.4,0.75 | smd 1.5 x 1.88: EP 0,0
MICRO-SD-SOCKET = smd 1.8 x 1.4: CD1 -2.05,0.4; CD2 -7.75,0.4 | smd 0.8 x 1.5: CS -7.84,10.3; DI -6.74,10.7; DO -2.34,10.7; GND -3.44,10.9; RSV1 -8.94,10.7; RSV2 -1.24,10.7; SCLK -4.54,10.7; VCC -5.64,10.9 | smd 1.4 x 1.9: GND1 -13.6,14.55; GND3 -0.45,13.55
2X_SPST = smd 0.25 x 0.75: P$1 0,0; P$2 0.5,0; P$3 1,0; P$4 1.5,0; P$5 1.5,3.1; P$6 1,3.1; P$7 0.5,3.1; P$8 0,3.1

### Placement (x,y rotation side)
C1  11.43,7.62 90 top
C2  44.45,39.37 180 top
C3  16.64,12.32 180 top
C4  10.16,30.48 180 top
C5  21.59,29.21 270 top
C6  50.8,33.02 90 bottom
C7  36.83,31.75 0 bottom
C8  38.1,34.29 0 bottom
C9  44.45,31.75 180 top
C10  12.7,25.4 180 top
C11  48.26,33.02 270 top
C12  50.8,33.02 270 top
C13  64.77,35.56 90 bottom
C14  64.77,30.48 270 bottom
D3  21.59,7.62 180 top
FRAME1  16.76,-11.43 0 top  (outside the outline)
IC1  44.45,33.02 270 bottom
J1  39.37,3.81 90 top
J2  61.37,3.81 90 top
J3  63.5,33.02 270 top
J4  31.75,13.97 270 top
J7  58.42,39.37 0 top
JP1  10.16,36.83 0 top
JP2  21.59,22.86 90 bottom
JP3  24.13,12.7 90 bottom
JP6  27.94,34.29 270 bottom
JP7  5.08,6.35 90 bottom
LED1  16.51,26.67 270 top
Q1  10.16,22.86 180 top
R1  20.6,28.24 90 bottom
R2  11.43,11.43 90 top
R3  21.87,28.24 90 bottom
R4  39.37,33.27 0 top
R5  62.23,35.56 180 bottom
R6  21.59,11.43 270 top
R7  62.23,30.48 0 bottom
R8  58.42,30.48 270 bottom
R9  55.88,30.48 90 bottom
R10  55.88,35.56 90 bottom
R11  16.51,31.75 0 top
R12  58.42,35.56 90 bottom
S1  16.51,8.89 180 top
SJ1  10.16,27.94 180 top
SJ2  38.1,36.83 0 bottom
SJ3  50.8,36.83 90 top
SJ4  39.37,38.1 270 top
SJ5  39.37,35.56 90 top
SJ6  35.56,36.83 0 bottom
SJ7  53.34,36.83 270 top
SJ8  44.45,3.81 0 top
SJ9  44.45,6.35 0 top
SJ10  35.56,20.32 180 top
SJ11  35.56,22.86 180 top
U1  16.51,19.05 315 top
U2  16.51,29.21 90 top
U3  44.45,35.56 90 top
U4  60.96,33.02 0 bottom
U$1  48.26,38.1 270 top
U$2  57.15,8.89 0 top
U$3  30.48,20.32 0 top

### Tracks (layer width: path | path; a pad name or v marks a point on that pad's centre or on a via)
3.3V  (via drill 0.51)
  Top 0.254: LED1.A 15.63,27.84 U2.5 | SJ11.2 v33.78,22.86 | v42.67,3.81 SJ8.1 | 30.99,24.12 30.72,24.12 30.52,23.93 30.52,23.46 U$3.P$8 30.48,21.59 30.99,21.08 U$3.P$2 | 30.99,24.12 31.24,24.12 31.43,23.93 31.43,23.46 U$3.P$6 | 30.99,24.12 v31.75,24.89
  Top 0.305: U2.5 12.45,28.26 | 12.45,28.26 10.89,28.26 SJ1.1 | C4.1 11.01,29.7 12.45,28.26 | C10.1 12.45,26.5 12.45,28.26 | 12.45,28.26 v12.45,30.23
  Bottom 0.254: v42.67,3.81 43.69,3.81 47.24,7.37 47.24,15.4 39.78,22.86 v33.78,22.86
  Bottom 0.305: v33.78,22.86 v31.75,24.89 30.5,26.14 30.5,33.56 28.48,35.59 23.7,35.59 20.93,32.82 19.15,32.82 16.56,30.23 v12.45,30.23
5V  (via drill 0.51)
  Top 0.254: SJ7.1 SJ3.2 v50.8,38.86 | v34.04,39.88 v36.58,39.88 37.59,40.89 v50.8,40.89
  Bottom 0.254: JP1.2 15.75,39.88 v34.04,39.88 | v36.58,39.88 35.97,39.27 SJ6.1 | v50.8,38.86 v50.8,40.89
  Bottom 0.305: SJ6.1 SJ2.2
A0
  Top 0.254: 21.88,16.51 JP6.8 | U1.23 21.88,16.51 | 21.88,16.51
A1
  Top 0.254: U1.24 21.52,17.84 21.59,17.78 26.67,17.78 JP6.7
A2
  Top 0.254: U1.25 23.01,21.59 JP6.6
A3
  Top 0.254: U1.26 21.88,21.59 22.36,21.59 22.82,22.05 25.86,22.05 JP6.5
A4  (via drill 0.51)
  Top 0.254: U1.27 21.59,22.43 JP2.1 23.09,24.36 24.92,24.36 25.96,25.4 28.47,25.4 30.43,27.36 30.43,31.06 | 30.43,31.06 28.47,33.02 27.41,33.02 24.13,36.3 24.13,37.36 23.39,38.1 22.33,38.1 21.06,36.83 JP1.5 | 30.43,31.06 42.13,31.06 42.72,30.46 52.05,30.46 v57.15,35.56
  Bottom 0.254: 20.6,27.54 19.94,26.88 19.94,24.94 21.59,23.29 JP2.1 | R1.1 20.6,27.54 | 20.6,27.54 20.65,27.59 | U4.8 58.62,34.71 R12.1 58,34.71 v57.15,35.56
A5  (via drill 0.51)
  Top 0.254: U1.28 19.83,22.07 20.24,22.48 20.24,24.05 JP2.2 23.45,25.4 24.04,24.82 24.73,24.82 25.22,25.31 25.22,25.75 27.41,27.94 28.47,27.94 29.21,28.68 29.21,29.74 28.47,30.48 24.3,30.48 22.86,31.92 JP1.6 | v26.67,36.83 29.19,36.83 v29.2,36.84
  Bottom 0.254: R3.1 21.87,25.68 JP2.2 | U4.7 56.9,33.27 55.88,34.29 R10.1 53,34.71 46.99,40.72 36.14,40.72 35.31,39.88 35.31,39.17 32.05,35.92 31.15,35.92 30.22,36.84 v29.2,36.84 | JP1.6 v26.67,36.83
A6
  Top 0.254: JP3.1 22.69,12.7 20.91,14.48 19.39,14.48 U1.19
A7
  Top 0.254: JP3.2 22.02,15.24 | 22.02,15.24 | 22.02,15.24 U1.22
AREF  (via drill 0.51)
  Top 0.254: 18.36,16.64 v18.03,16.64 18.36,16.64 | U1.20 18.36,16.64 | v13.59,8.13 13.25,8.47 C1.2
  Bottom 0.254: v18.03,16.64 18.03,16.76 16.13,18.67 15.11,18.67 14.1,17.65 14.1,16.13 17.53,12.7 17.53,9.4 16.76,8.64 14.1,8.64 v13.59,8.13
D2  (via drill 0.51)
  Top 0.254: U1.32 16.76,24.87 v16.76,24.89
  Bottom 0.254: v16.76,24.89 16.69,24.89 15.93,24.13 JP7.8 3.81,25.4 3.81,32.28 4.55,33.02 15.88,33.02 16.51,33.65 16.51,37.36 17.25,38.1 26.64,38.1 34.11,30.64 34.11,29.31 35.18,28.24 56.01,28.24 56.71,28.94 56.71,29.62 R8.1 58.62,31.33 U4.5
D3  (via drill 0.51)
  Top 0.254: 17.14,22.38 v17.14,21.97 17.14,22.38 | U1.1 17.14,22.38
  Bottom 0.254: JP7.7 5.59,21.08 15.62,21.08 16.51,21.97 v17.14,21.97
D4  (via drill 0.51)
  Top 0.254: v16.51,20.7 16.76,20.7 16.26,21.21 16.26,22.35 15.75,22.86 15.53,22.86 | U1.2 15.53,22.86 | 15.53,22.86 | 32.94,22.51 32.94,23.21 34.12,24.38 v34.29,24.38 | 32.94,22.51 33.44,22.02 33.45,22.02 SJ10.2 | 32.94,22.51 31.08,22.51 30.98,22.61 U$3.P$7
  Bottom 0.254: v16.51,20.7 16.38,20.57 6.6,20.57 JP7.6 0.76,14.73 0.76,8.87 4.55,5.08 34.93,5.08 38.15,1.86 48.77,1.86 53.42,6.51 53.42,9.87 39.97,23.32 34.85,23.32 34.29,23.88 v34.29,24.38
D5  (via drill 0.51)
  Top 0.254: JP7.5 5.46,16.51 6.48,17.53 11.03,17.53 U1.9 | SJ9.1 43.78,6.1 v42.67,6.1 | v46.41,11.18 48.69,13.46 v51.31,13.46 | v6.86,4.06 5.84,5.08 4.55,5.08 1.78,7.86 v1.78,9.4 | v35.05,26.41 35,26.36 31.31,26.36 29.52,24.57 29.52,20.32 30.22,19.61 31.24,19.61 31.45,19.82 31.45,20.29 U$3.P$3 | v39.12,26.42 41.24,24.29 v41.24,11.18
  Bottom 0.254: v46.41,11.18 46.41,9.83 v42.67,6.1 41.24,7.53 v41.24,11.18 | v51.31,13.46 51.31,12.63 53.87,10.06 53.87,6.32 48.95,1.4 37.96,1.4 35.3,4.06 v6.86,4.06 | JP7.5 3.3,16.51 1.22,14.43 1.22,9.96 v1.78,9.4 | v35.05,26.41 v39.11,26.41 v39.12,26.42
D6  (via drill 0.51)
  Top 0.254: 5.08,14.26 JP7.4 5.08,14.61 6.35,15.88 6.35,16.64 6.6,16.89 11.52,16.89 | U1.10 11.52,16.89 | 11.52,16.89 | R4.2 40.22,34.3 SJ5.1 39.19,35.32 38.6,35.32 36.33,37.59 v32.51,37.59 | v2.29,14.22 2.9,14.83 2.9,35.2 6.74,39.04 v30.48,39.04
  Bottom 0.254: JP7.4 2.54,13.97 v2.29,14.22 | v30.48,39.04 31.93,37.59 v32.51,37.59
D7
  Top 0.254: U1.11 12.02,16.26 7.11,16.26 6.86,16 6.86,15.62 6.35,15.11 6.35,13.34 5.08,12.06 JP7.3 3.94,12.57 3.81,12.7 3.81,34.82 7.09,38.1 13.23,38.1 14.5,36.83 JP1.3
D8
  Top 0.254: U1.12 12.64,15.75 7.49,15.75 7.37,15.62 7.37,15.37 6.86,14.86 6.86,13.08 6.35,12.57 6.35,10.79 5.08,9.53 JP7.2 3.35,10.62 3.35,35.01 6.91,38.56 15.31,38.56 17.04,36.83 JP1.4
D9
  Top 0.254: JP7.1 5.08,6.99 6.35,8.26 6.35,10.03 6.86,10.54 6.86,12.32 7.37,12.83 7.37,14.61 7.75,14.99 13.01,14.99 U1.13
D10  (via drill 0.51)
  Top 0.254: v9.91,6.6 10.6,7.3 10.6,12.97 10.79,13.16 12.32,13.16 U1.14 | v42.16,13.46 47.21,18.51 48.99,18.51 49.53,19.05 49.39,19.19 U$2.CS
  Bottom 0.254: v9.91,6.6 10.92,5.59 18,5.59 20.03,7.62 22.96,7.62 24.23,6.35 JP6.12 37.59,6.35 38.34,5.61 38.34,2.97 38.53,2.77 40.21,2.77 40.41,2.97 40.41,11.7 v42.16,13.46
GND  (via drill 0.51)
  Top 0.254: v19.3,29.21 17.78,29.21 | U1.3 15.29,21.97 15.37,21.97 | C1.1 11.64,6.99 S1.2 | U1.5 13.97,21.02 v13.97,19.56 | D3.C 21.35,6.99 S1.1 | Q1.2 10.16,23.88 11.68,25.4 C10.2 | C5.2 23.11,29.88 v23.11,30.48 | U3.13 U3.14 44.7,36.06 | U3.11 U3.12 44.7,35.31 U3.15 | U3.15 44.2,35.31 U3.11 | U3.13 44.2,35.81 44.32,35.69 | 44.32,35.69 U3.15 | U3.4 44.7,36.06 | 44.7,36.06 44.32,35.69 | 44.45,35.81 43.7,35.06 U3.9 42.95,35.04 42.41,35.04 42.22,34.84 42.22,33.76 40.91,32.44 39.53,32.44 38.7,33.27 R4.1 37,34.8 v35.81,34.8 34.29,33.27 v33.78,33.27 | v63.5,34.29 64.76,33.03 | 64.76,33.03 v65.6,33.03 | v63.5,31.75 64.76,33.01 64.76,33.03 | J7.1 59.8,37.99 J3.1 59.78,34.04 56.9,34.04 v53.09,30.23 52.07,29.21 v35.81,29.21 | U3.11 44.2,32.35 C9.2 | v52.58,33.27 51.9,33.27 C12.2 C11.2 | U$2.CD2 49.4,8.25 v48.01,6.86 | v52.58,6.86 52.67,6.86 U$2.CD1 | J1.1 37.85,5.33 v37.08,5.33 v37.08,7.87 | U3.13 43.71,37.55 v43.18,37.55 | v41.15,39.62 43.35,39.62 C2.2 | v33.27,20.07 33.02,20.32 U$3.P$4
  Bottom 0.254: 61.09,33.02 U4.EP | 61.09,33.02 61.82,32.29 62.34,32.29 U4.4 62.88,31.75 v63.5,31.75 | 61.09,33.02 61.84,33.77 U4.1 62.88,34.29 v63.5,34.29 | C13.2 65.6,35.58 65.6,33.77 v65.6,33.03 65.6,30.46 C14.2 | C6.2 51.08,34.77 v52.58,33.27 52.58,30.73 v53.09,30.23 | v52.58,6.86 v48.01,6.86 43.47,2.32 38.34,2.32 37.88,2.78 37.88,4.54 v37.08,5.33 | J4.6 35.43,7.87 v37.08,7.87 | v35.81,34.8 36.07,34.8 36.58,34.29 C8.2 | v41.15,39.62 42.33,39.62 43,38.95 43,37.73 v43.18,37.55 45.4,35.33 IC1.1 | v33.78,33.27 35.08,31.98 C7.2 35.08,29.95 v35.81,29.21 | v33.3,17.07 33.3,20.04 v33.27,20.07 | v24.41,32.31 24.41,31.77 v23.11,30.48
  Bottom 0.305: 34.42,8.76 J4.6
  other vias: 19.05,17.78 16.51,6.99 12.73,34.37 18.03,25.4 15.34,22.02 8,31.88 13.97,29.21 15.27,34.34 19.43,12.45 24.38,25.65 31.78,28.75 42.19,11.99 42.19,8.94 41.43,5.13 12.47,2.34 22.63,2.34 17.55,2.34 27.46,2.34 53.62,26.72 58.7,26.72 63.27,26.72 58.7,20.12 44.73,26.72 48.54,26.72 6.38,40.44 1.3,35.1 1.3,25.96 1.3,21.39 64.54,21.39 64.54,16.81 64.54,12.24 64.54,7.92 31.52,2.34 36.86,17.07 36.86,14.02 36.86,11.23 17.81,34.34 12.22,40.44 55.65,38.15 52.86,38.66 55.65,32.82 24.41,23.42 24.41,19.35 8.92,19.1 8.92,13 8.92,8.43 37.11,24.18 42.19,17.32 58.7,16.31 56.67,6.91 7.65,2.34 1.3,5.13 1.3,17.83 1.3,30.53 8,27.56 8,25.02 7.39,36.4 12.73,31.57 52.6,1.32 56.67,1.32 61.49,1.32 47.52,3.1 35.33,2.34 30.25,16.56 14,13.51 20.35,34.34 30.99,35.05 33.78,35.05
  pour Top (isolate 0.305): -3.81,45.72 71.12,45.72 71.12,-3.81 -3.81,-3.81
  pour Bottom (isolate 0.305): -2.03,43.94 69.85,44.45 69.85,-2.54 -2.03,-2.54
MISO  (via drill 0.51)
  Top 0.254: U1.16 15.88,14.46 15.88,17.53 v15.62,17.78 | v30.23,7.37 32,7.37 37.51,1.86 44.98,1.86 54.44,11.32 54.44,19.22 U$2.DO
  Bottom 0.254: v15.62,17.78 18.54,14.86 18.54,10.03 19.05,9.53 26.04,9.53 JP6.10 29.34,11.43 J4.1 33.15,12.7 34.69,12.7 35.43,11.96 35.43,10.9 34.69,10.16 33.54,10.16 33.15,9.77 33.15,8.36 32.15,7.37 v30.23,7.37
MOSI  (via drill 0.51)
  Top 0.254: v14.99,16.64 15.37,16.26 15.37,15.08 U1.15 | J4.4 36.05,9.54 36.05,6.35 36.05,5 38.27,2.77 40.21,2.77 40.41,2.97 40.41,8.67 50.41,18.67 U$2.DI
  Bottom 0.254: v14.99,16.64 18.06,13.56 18.06,9.63 18.8,8.89 JP6.11 30.08,8.89 31.35,10.16 32.89,10.16 J4.4
N$1
  Top 0.254: Q1.3 8.96,21.77 10.16,20.57 11.03,20.57 U1.8
N$2
  Top 0.254: 11.78,20.95 U1.7 12.06,20.71 11.36,21.41 Q1.1
N$3
  Bottom 0.254: R5.2 63.92,35.56 C13.1 64.77,33.53 64.52,33.27 U4.2
N$4
  Top 0.254: R11.2 16.26,30.65 16.26,27.8 LED1.C
N$5
  Top 0.254: U3.1 45.92,32.38 C9.1
N$6
  Bottom 0.305: SJ2.1 38.51,34.29 C8.1
  Bottom 0.406: IC1.2 IC1.4 39.85,33.02 | C7.1 39.85,33.02 | C8.1 39.85,33.38 39.85,33.02
N$7
  Top 0.254: D3.A R6.2
N$8
  Top 0.254: U3.3 47.48,35.56 U$1.2
N$9
  Top 0.254: 46.68,34.84 46.49,35.04 45.95,35.04 U3.2 | U3.10 42.98,32.64 42.72,32.39 42.72,31.11 42.91,30.92 45.99,30.92 46.68,31.61 46.68,34.84 | SJ3.1 C12.1 C11.1 47.66,33.87 46.68,34.84
N$10
  Top 0.254: SJ4.2 39.37,37.08 | 39.37,37.08 39.37,36.83 | 39.37,36.83 39.37,36.58 | 39.37,36.58 SJ5.2 | U3.6 42.7,36.83 39.62,36.83 | 39.62,36.83 39.37,36.83 | 39.37,37.08 39.62,36.83 | 39.37,36.58 39.62,36.83
N$20  (via drill 0.51)
  Top 0.254: SJ8.2 SJ9.2 44.86,12.43 51.49,19.05 51.78,19.05 51.78,19.52 U$2.VCC 51.51,23.42 v51.31,23.62 | U$3.P$5 33.02,24.46 v33.02,25.07
  Bottom 0.254: v33.02,25.07 33.79,25.07 33.94,25.22 49.71,25.22 v51.31,23.62
N$21
  Top 0.254: 39.4,21.84 J1.10 37.88,20.32 SJ10.1 SJ11.1 35.97,24.23 34.29,25.91 31.5,25.91 29.97,24.38 29.97,20.83 U$3.P$1
QST
  Bottom 0.254: U4.6 56.9,32.77 55.88,31.75 R9.2
RAW  (via drill 0.51)
  Top 0.254: U2.3 17.81,30.21 17.82,30.23 | U3.7 U3.8 41.91,35.56 v41.66,35.81 | U3.5 arc90 45.97,36.61 45.97,36.83 45.97,37.08
  Top 0.406: U2.1 17.54,28.53 17.04,28.53 16.8,28.77 16.8,29.65 17.04,29.89 17.54,29.89 U2.3 18.8,31.15 v18.8,31.24 | C5.1 v21.59,32.26 | J3.2 60.89,33.11 62.27,33.11 62.51,33.35 62.51,34.69 60.96,36.23 J7.2 59.61,40.72 57.1,40.72 56.24,39.85 U$1.1 v48.26,38.1 47.77,38.1 46.51,36.83 45.97,36.83 45.97,38.61 | C2.1 45.92,38.74 arc-90 45.97,38.7 45.97,38.61 | 45.97,38.61 45.83,38.46 42.27,38.46 v42.16,38.35 41.98,38.35 41.82,38.51 SJ4.1 31.4,38.51 30.11,37.23 30.11,36.46 JP6.1
  Bottom 0.254: R7.2 59.27,30.48 R8.2 | R5.1 59.27,35.56 R12.2 R10.2
  Bottom 0.406: v18.8,31.24 19.81,32.26 v21.59,32.26 23.62,34.29 JP6.1 | C6.1 50.24,30.71 IC1.3 49.07,32.23 49.07,36.11 48.26,36.92 v48.26,38.1 | J7.2 61.38,38.95 R5.1 61.45,35.56 63.26,37.37 65.44,37.37 66.69,36.11 66.69,29.93 65.44,28.67 64.1,28.67 64.07,28.7 62.99,28.7 61.38,30.31 R7.2 | v41.66,35.81 42.16,36.32 v42.16,38.35
RESET  (via drill 0.51)
  Top 0.254: JP6.3 24.38,29.21 24.38,27.05 24.13,26.8 20.57,26.8 19.68,25.91 19.68,22.79 U1.29 | v18.92,20.07 18.54,20.45 18.54,21.65 U1.29 | R2.1 11.55,10.7 11.59,10.7 11.68,10.79 S1.4 16.38,10.79 v16.51,10.67 16.64,10.79 S1.3 20.76,9.34 20.76,7.95 21.04,7.67 24.92,7.67 27.41,10.16 28.47,10.16 29.74,8.89 J4.5 | U1.29
  Bottom 0.254: v16.51,10.67 16.51,12.7 13.59,15.62 13.59,17.91 14.86,19.18 16.38,19.18 17.34,18.22 17.97,18.22 18.67,18.92 18.67,19.81 v18.92,20.07 19,20.14 19,26.82 18.57,27.25 17.22,27.25 15.56,25.59 15.37,25.4 8.89,25.4 JP7.10
RXI  (via drill 0.51)
  Top 0.254: U1.30 18.03,22.27 18.03,19.68 18.67,19.05 v19.81,19.05 19.89,19.13 21.41,19.13 22.6,20.32 28.47,20.32 29.94,18.85 35.92,18.85 36.88,19.81 J1.9 | U1.30
  Bottom 0.254: v19.81,19.05 19.81,24.23 19.48,24.56 19.48,27.23 18.95,27.76 16.84,27.76 15.11,26.04 10.79,26.04 JP7.11
SCK
  Top 0.254: U1.17 18.14,13.46 20.41,13.46 R6.1 23.2,10.67 25.15,10.67 26.16,11.68 26.16,13.21 26.92,13.97 JP6.9 30.48,11.43 J4.3 33.15,9.91 33.15,7 37.83,2.32 44.79,2.32 52.24,9.77 52.24,19.22 U$2.SCLK
TXO  (via drill 0.51)
  Top 0.254: U1.31 18.13,23.77 18.87,24.51 18.87,27.59 20.14,28.86 20.14,31.08 18.64,32.58 | JP7.12 8.72,34.29 10.43,32.58 18.64,32.58 | J1.8 39.37,18.35 40.41,19.38 40.41,22.24 32.77,29.88 v32.77,30.22 | v31.66,31.89 31.66,32.51 32.84,33.69 32.84,35.41 32.35,35.9 v31.5,36.75 | 18.64,32.58 19.05,32.99 19.05,37.36 20.28,38.58 28.7,38.58 29.18,38.1 v29.21,38.1
  Bottom 0.254: v32.77,30.22 32.77,30.79 v31.66,31.89 | v29.21,38.1 30.15,38.1 v31.5,36.75
VCC  (via drill 0.51)
  Top 0.254: 16.51,16.22 16.56,16.18 16.51,16.13 | 16.51,16.13 16.51,16.22 | 16.51,16.22 16.51,18.29 15.75,19.05 14.86,19.05 | 14.86,19.05 14.86,18.67 14.48,18.29 13.59,18.29 13.08,18.8 13.08,20.78 U1.6 | 14.86,19.05 14.86,21.27 U1.4 | 16.51,16.13 16.51,13.04 C3.2 15.75,12.28 R2.2 | U1.18 16.51,16.22 | 13.76,22.39 U1.4 | U1.4 13.35,22.78 13.35,23.32 14.43,24.41 14.43,26.97 v14.22,27.18 | SJ1.2 7.87,29.81 v7.87,30.48 | v29.64,33.03 31,33.03 v32,34.04 | SJ7.2 54.1,35.66 v54.1,33.78
  Bottom 0.254: v7.87,30.48 11.18,27.18 v14.22,27.18 15.37,28.32 19.83,28.32 R1.2 R3.2 22.08,28.88 22.61,28.88 24.82,26.67 JP6.4 29.64,28.37 v29.64,33.03 | v32,34.04 32.13,34.16 34.8,34.16 | v54.1,33.78 54.1,30.06 53.25,29.21 37.59,29.21 36.07,30.73 36.07,33.14 35.05,34.16 34.8,34.16 | SJ6.2 35.15,35.32 34.98,35.15 34.98,34.34 34.8,34.16
  Bottom 0.305: J4.2 29.23,19.15 29.23,24.67 27.94,25.96 JP6.4
VDD
  Bottom 0.254: R7.1 63.92,30.48 C14.1 64.77,32.51 64.52,32.77 U4.3

### Text on the board
Bottom: v14
tPlace: TXO | RAW | RXI | GND | RST | RST | GND | VCC | 2 | A3 | 3 | A2 | 4 | A1 | 5 | A0 | 6 | 13 | 7 | Reset | 12 | 8 | 11 | 9 | 10
bPlace: A5 | A4 | A7 | SmartLoo Sensor Node V1.0 / Designed by Brandon Ng / 3/17/18 / / Team 20: / Arturo Asmal / Ben Corn / Bonnie To / Brandon Ng / Sarah Araujo | A6